# Altium schematic sheet PCI short card universal - 32 BIT-5.schdoc
size A3
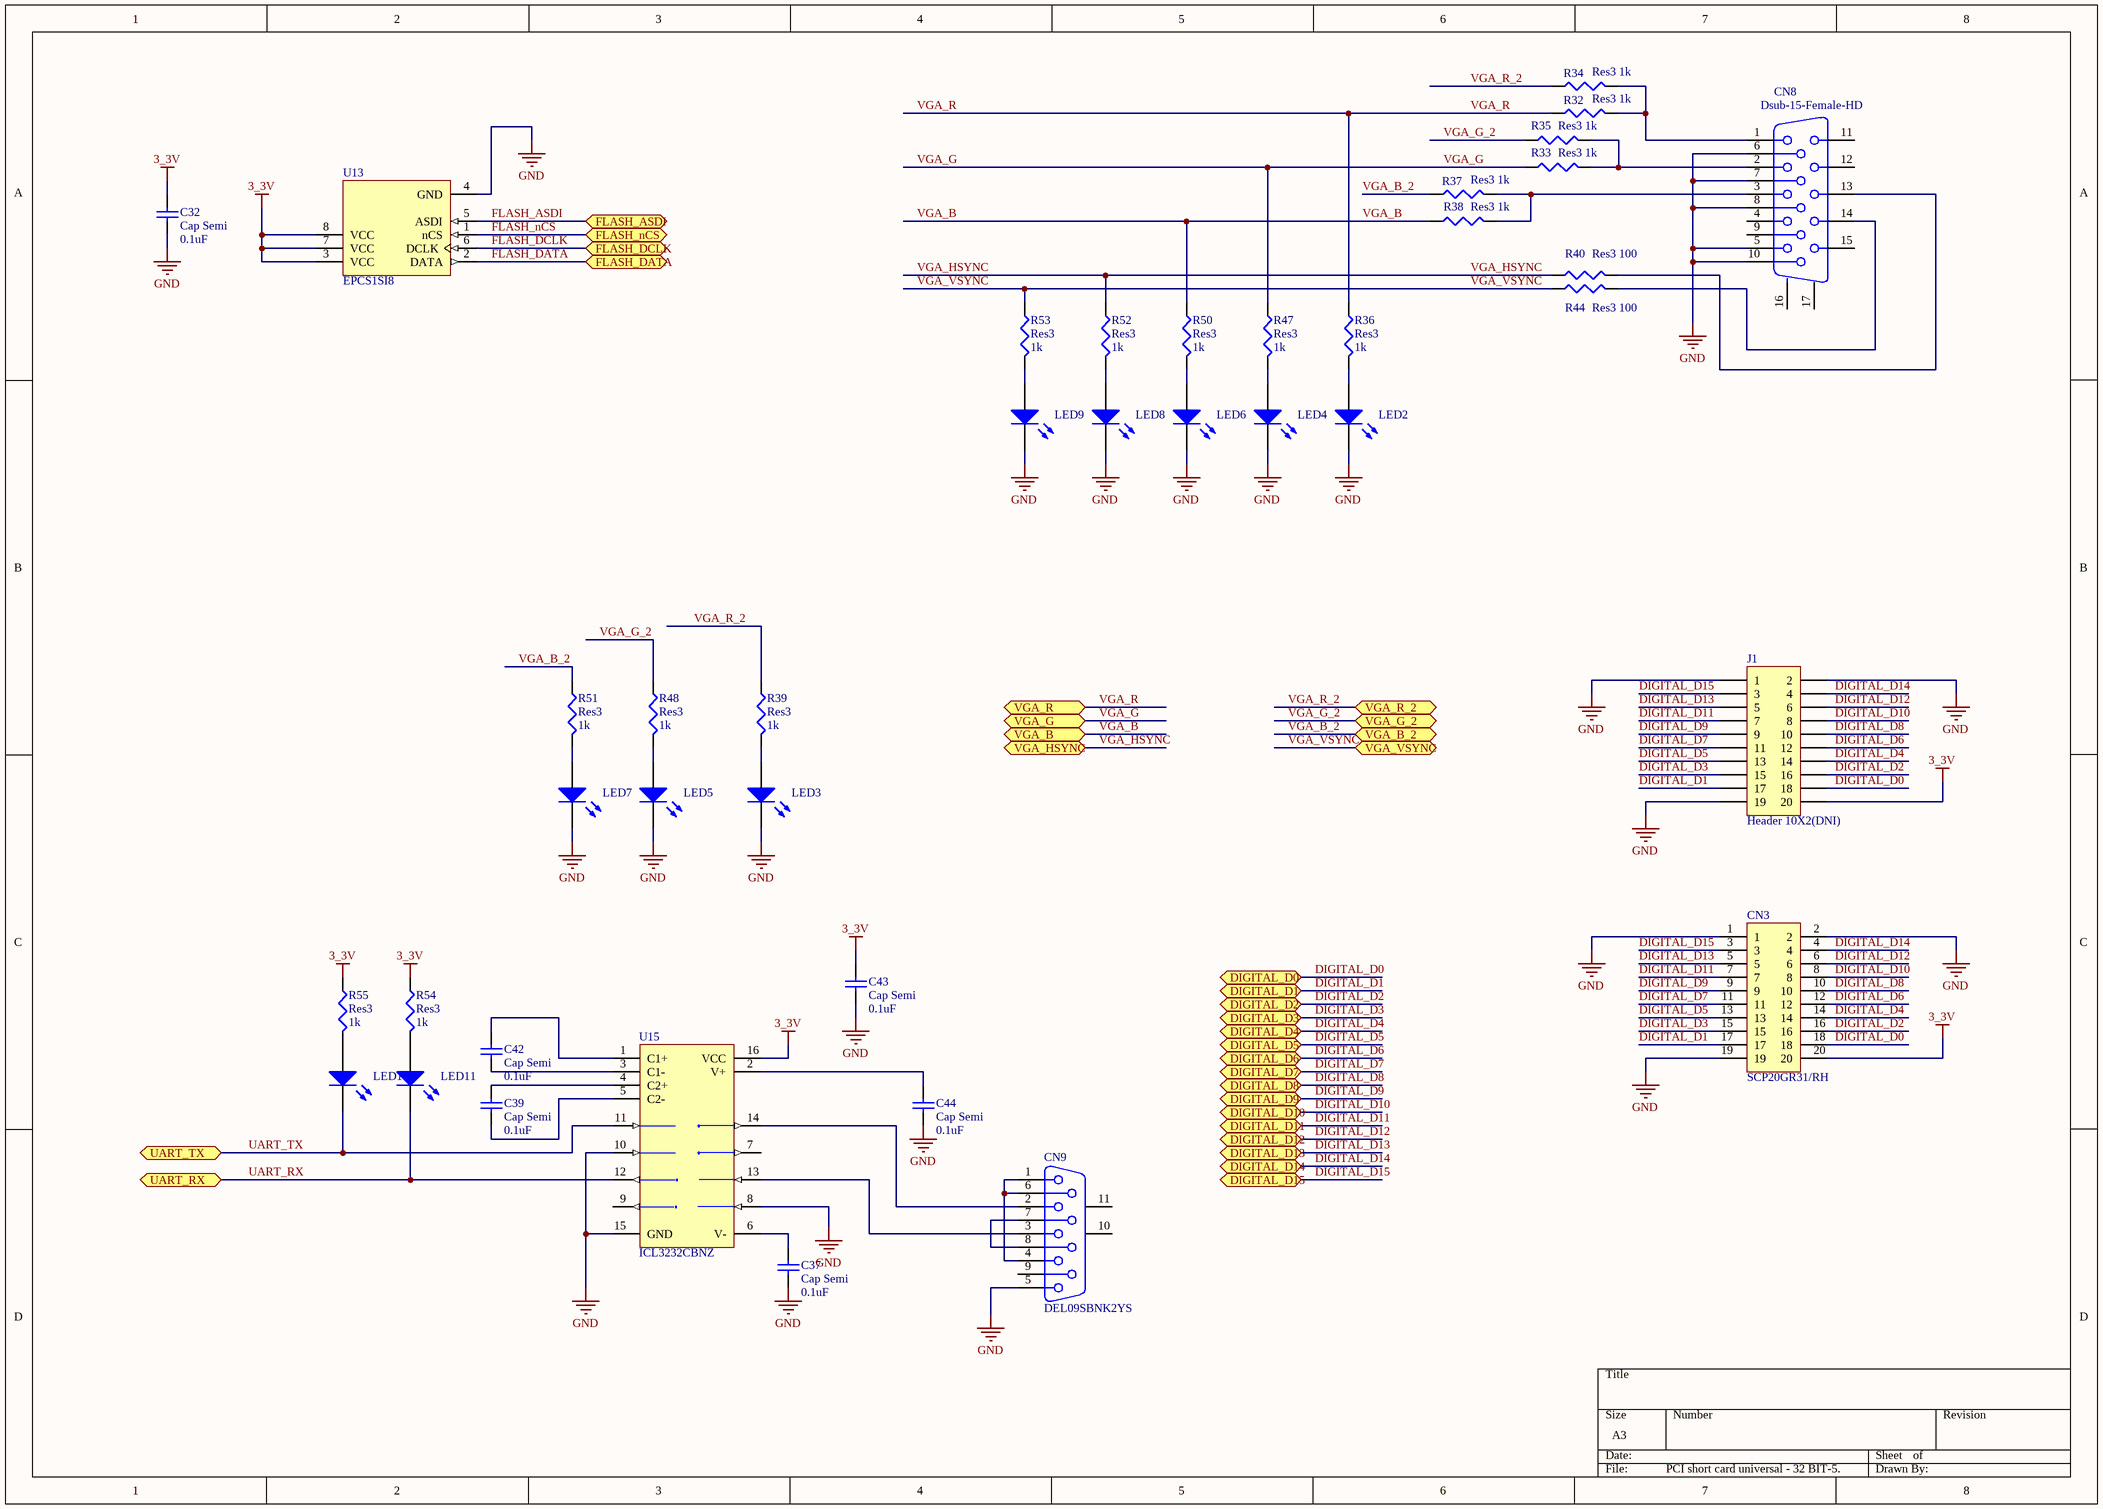
[diagram p0: PCI short card universal - 32 BIT-5.schdoc]

## Parts
C32  Cap Semi  value 0.1uF  [RESC1608N]
C37  Cap Semi  value 0.1uF  [RESC1608N]
C39  Cap Semi  value 0.1uF  [RESC1608N]
C42  Cap Semi  value 0.1uF  [RESC1608N]
C43  Cap Semi  value 0.1uF  [RESC1608N]
C44  Cap Semi  value 0.1uF  [RESC1608N]
CN3  SCP20GR31/RH  [SCP20GR31/RH]
CN8  Dsub-15-Female-HD  [DB15-VGA-Female]
CN9  DEL09SBNK2YS  [DSUB1.385-2H9]
J1  Header 10X2(DNI)  [HDR2X10]
LED2  LED2  [LED3.2X1.6X1.1]  (value not drawn)
LED3  LED2  [LED3.2X1.6X1.1]  (value not drawn)
LED4  LED2  [LED3.2X1.6X1.1]  (value not drawn)
LED5  LED2  [LED3.2X1.6X1.1]  (value not drawn)
LED6  LED2  [LED3.2X1.6X1.1]  (value not drawn)
LED7  LED2  [LED3.2X1.6X1.1]  (value not drawn)
LED8  LED2  [LED3.2X1.6X1.1]  (value not drawn)
LED9  LED2  [LED3.2X1.6X1.1]  (value not drawn)
LED10  LED2  [LED3.2X1.6X1.1]  (value not drawn)
LED11  LED2  [LED3.2X1.6X1.1]  (value not drawn)
R32  Res3  value 1k  [RESC1608N]
R33  Res3  value 1k  [RESC1608N]
R34  Res3  value 1k  [RESC1608N]
R35  Res3  value 1k  [RESC1608N]
R36  Res3  value 1k  [RESC1608N]
R37  Res3  value 1k  [RESC1608N]
R38  Res3  value 1k  [RESC1608N]
R39  Res3  value 1k  [RESC1608N]
R40  Res3  value 100  [RESC1608N]
R44  Res3  value 100  [RESC1608N]
R47  Res3  value 1k  [RESC1608N]
R48  Res3  value 1k  [RESC1608N]
R50  Res3  value 1k  [RESC1608N]
R51  Res3  value 1k  [RESC1608N]
R52  Res3  value 1k  [RESC1608N]
R53  Res3  value 1k  [RESC1608N]
R54  Res3  value 1k  [RESC1608N]
R55  Res3  value 1k  [RESC1608N]
U13  EPCS1SI8  [SOIC8_L]
U15  ICL3232CBNZ  [NSO16_M]

## Ports
DIGITAL_D0, DIGITAL_D1, DIGITAL_D2, DIGITAL_D3, DIGITAL_D4, DIGITAL_D5, DIGITAL_D6, DIGITAL_D7, DIGITAL_D8, DIGITAL_D9, DIGITAL_D10, DIGITAL_D11, DIGITAL_D12, DIGITAL_D13, DIGITAL_D14, DIGITAL_D15, FLASH_ASDI, FLASH_DATA, FLASH_DCLK, FLASH_nCS, UART_RX, UART_TX, VGA_B, VGA_B_2, VGA_G, VGA_G_2, VGA_HSYNC, VGA_R, VGA_R_2, VGA_VSYNC

## Nets
3_3V: C32.2 C43.2 CN3.20 J1.20 R54.1 R55.1 U13.3(VCC) U13.7(VCC) U13.8(VCC) U15.16(VCC)
GND: C32.1 C37.1 C43.1 C44.1 CN3.1 CN3.2 CN3.19 CN8.5 CN8.6 CN8.7 CN8.8 CN8.10 CN9.5 J1.1 J1.2 J1.19 LED2.2(K) LED3.2(K) LED4.2(K) LED5.2(K) LED6.2(K) LED7.2(K) LED8.2(K) LED9.2(K) U13.4(GND) U15.8(R2IN) U15.10(T2IN) U15.15(GND)
DIGITAL_D0: CN3.18 J1.18 ; port DIGITAL_D0
DIGITAL_D1: CN3.17 J1.17 ; port DIGITAL_D1
DIGITAL_D2: CN3.16 J1.16 ; port DIGITAL_D2
DIGITAL_D3: CN3.15 J1.15 ; port DIGITAL_D3
DIGITAL_D4: CN3.14 J1.14 ; port DIGITAL_D4
DIGITAL_D5: CN3.13 J1.13 ; port DIGITAL_D5
DIGITAL_D6: CN3.12 J1.12 ; port DIGITAL_D6
DIGITAL_D7: CN3.11 J1.11 ; port DIGITAL_D7
DIGITAL_D8: CN3.10 J1.10 ; port DIGITAL_D8
DIGITAL_D9: CN3.9 J1.9 ; port DIGITAL_D9
DIGITAL_D10: CN3.8 J1.8 ; port DIGITAL_D10
DIGITAL_D11: CN3.7 J1.7 ; port DIGITAL_D11
DIGITAL_D12: CN3.6 J1.6 ; port DIGITAL_D12
DIGITAL_D13: CN3.5 J1.5 ; port DIGITAL_D13
DIGITAL_D14: CN3.4 J1.4 ; port DIGITAL_D14
DIGITAL_D15: CN3.3 J1.3 ; port DIGITAL_D15
FLASH_ASDI: U13.5(ASDI) ; port FLASH_ASDI
FLASH_DATA: U13.2(DATA) ; port FLASH_DATA
FLASH_DCLK: U13.6(DCLK) ; port FLASH_DCLK
FLASH_nCS: U13.1(nCS) ; port FLASH_nCS
UART_RX: LED11.2(K) U15.12(R1OUT) ; port UART_RX
UART_TX: LED10.2(K) U15.11(T1IN) ; port UART_TX
VGA_B: R38.1 R50.1 ; port VGA_B
VGA_B_2: R37.1 R51.1 ; port VGA_B_2
VGA_G: R33.1 R47.1 ; port VGA_G
VGA_G_2: R35.1 R48.1 ; port VGA_G_2
VGA_HSYNC: R40.1 R52.1 ; port VGA_HSYNC
VGA_R: R32.1 R36.1 ; port VGA_R
VGA_R_2: R34.1 R39.1 ; port VGA_R_2
VGA_VSYNC: R44.1 R53.1 ; port VGA_VSYNC
NetC37_2: C37.2 U15.6(V-)
NetC39_1: C39.1 U15.5(C2-)
NetC39_2: C39.2 U15.4(C2+)
NetC42_1: C42.1 U15.3(C1-)
NetC42_2: C42.2 U15.1(C1+)
NetC44_2: C44.2 U15.2(V+)
NetCN8_1: CN8.1 R32.2 R34.2
NetCN8_2: CN8.2 R33.2 R35.2
NetCN8_3: CN8.3 R37.2 R38.2
NetCN8_13: CN8.13 R40.2
NetCN8_14: CN8.14 R44.2
NetCN9_1: CN9.1 CN9.4 CN9.6
NetCN9_2: CN9.2 U15.14(T1OUT)
NetCN9_3: CN9.3 U15.13(R1IN)
NetCN9_7: CN9.7 CN9.8
NetLED2_1: LED2.1(A) R36.2
NetLED3_1: LED3.1(A) R39.2
NetLED4_1: LED4.1(A) R47.2
NetLED5_1: LED5.1(A) R48.2
NetLED6_1: LED6.1(A) R50.2
NetLED7_1: LED7.1(A) R51.2
NetLED8_1: LED8.1(A) R52.2
NetLED9_1: LED9.1(A) R53.2
NetLED10_1: LED10.1(A) R55.2
NetLED11_1: LED11.1(A) R54.2

Not connected (* = marked no-connect by the designer): CN8 4 9 11 12 15 16(MH1) 17(MH2); CN9 9 10(MH1) 11(MH2); U15 7(T2OUT) 9(R2OUT)

## Library data of the parts
C32 C37 C39 C42-C44 = Cap Semi: Capacitor (Semiconductor SIM Model); Published: 8-Jun-2000; LatestRevisionDate: 17-Jul-2002; LatestRevisionNote: Re-released for DXP Platform.; PackageReference: C1206; Publisher: Altium Limited
CN3 = SCP20GR31/RH: GTK
CN8 = Dsub-15-Female-HD: Dsub-15 High density VGA Female connetor; Manufacturer: Generic Components; Package Information: Latest Revision: E; Class I: Connector; Positions: 30; Gender: Receptacle Header; Fitted: True; Published: 15-Jun-2001; Revision: July-2002: Re-released for DXP Platform.; Datasheet: (31-Oct-1991); Package Reference: 174213; Publisher: Altium Limited; Orientation: Right Angle
CN9 = D Connector 9: GTK; PackageDocument: O; Positions: 9; Gender: Receptacle; Published: 15-Jun-2001; LatestRevisionDate: 17-Jul-2002; LatestRevisionNote: Re-released for DXP Platform.; DatasheetDocument: 1-Sep-1999; PackageReference: 788750; Publisher: Altium Limited; Orientation: Right Angle
J1 = Header 10X2: Header, 10-Pin, Dual row; LatestRevisionDate: 17-Jul-2002; LatestRevisionNote: Re-released for DXP Platform.; Publisher: Altium Limited
LED2-LED9 = LED2: OASISTEK (TO-3216BC-MAE); Published: 8-Jun-2000; LatestRevisionDate: 17-Jul-2002; LatestRevisionNote: Re-released for DXP Platform.; PackageDocument: Feb-2002; PackageReference: 3.2X1.6X1.1; Publisher: Altium Limited
LED10 LED11 = LED2: Typical RED, GREEN, YELLOW, AMBER GaAs LED; Published: 8-Jun-2000; LatestRevisionDate: 17-Jul-2002; LatestRevisionNote: Re-released for DXP Platform.; PackageDocument: Feb-2002; PackageReference: 3.2X1.6X1.1; Publisher: Altium Limited
R32-R40 R44 R47 R48 R50-R55 = Res3: Resistor; Published: 8-Jun-2000; LatestRevisionDate: 04-Mar-2005; LatestRevisionNote: PCB Footprint replaced.; PackageReference: J1-0603; Publisher: Altium Limited
U13 = EPCS1SI8: ALTERA EPCS1 Series, In-system programmable 3.3V serial configuration device, 8-Pin SOIC, 1-Megabit, Industrial Grade; Configures: Cyclone II, Stratix II, & Cyclone Devices; Published: 17-Sep-2003; LatestRevisionDate: 13-Apr-2006; LatestRevisionNote: IPC-7351 Footprint Added.; DatasheetVersion: ver2.0, Oct-2003; PackageVersion: ver13.0, May-2005; PackageReference: SOIC8; Publisher: Altium Limited; PackageDescription: 8-Pin Small Outline Integrated Circuit Package (SOIC8); Code_JEDEC: MS-012-AA; Code_IPC: SOIC127P600-8; ComponentLink1Description: Manufacturer Link; ComponentLink1URL: http://www.altera.com/products/devices/config/cfg-index.html; ComponentLink2Description: Configuration Handbook; ComponentLink2URL: http://www.altera.com/literature/hb/cfg/config_handbook.pdf; ComponentLink3Description: Pinout Specification; ComponentLink3URL: http://www.altera.com/literature/hb/cfg/cyc_c51014.pdf; ComponentLink4Description: Packaging Specification; ComponentLink4URL: http://www.altera.com/literature/ds/dspkg.pdf
U15 = MAX3232CSE: INTERSIL; Published: 16-Jan-2001; LatestRevisionDate: 13-Apr-2006; LatestRevisionNote: IPC-7351 Footprint Added.; DatasheetVersion: Mar-1999; PackageReference: NSO16; Publisher: Altium Limited; PackageDescription: 16-Pin Small Outline Integrated Circuit 1.27 mm Pitch; Code_JEDEC: MS-012-AC; Code_IPC: SOIC127P600-16; ComponentLink1Description: Manufacturer Link; ComponentLink1URL: http://www.maxim-ic.com/; ComponentLink2Description: Datasheet; ComponentLink2URL: http://pdfserv.maxim-ic.com/en/ds/MAX3222-MAX3241.pdf